# EAGLE design fabflash-mk-2.2-driver (EAGLE 6.5.0)
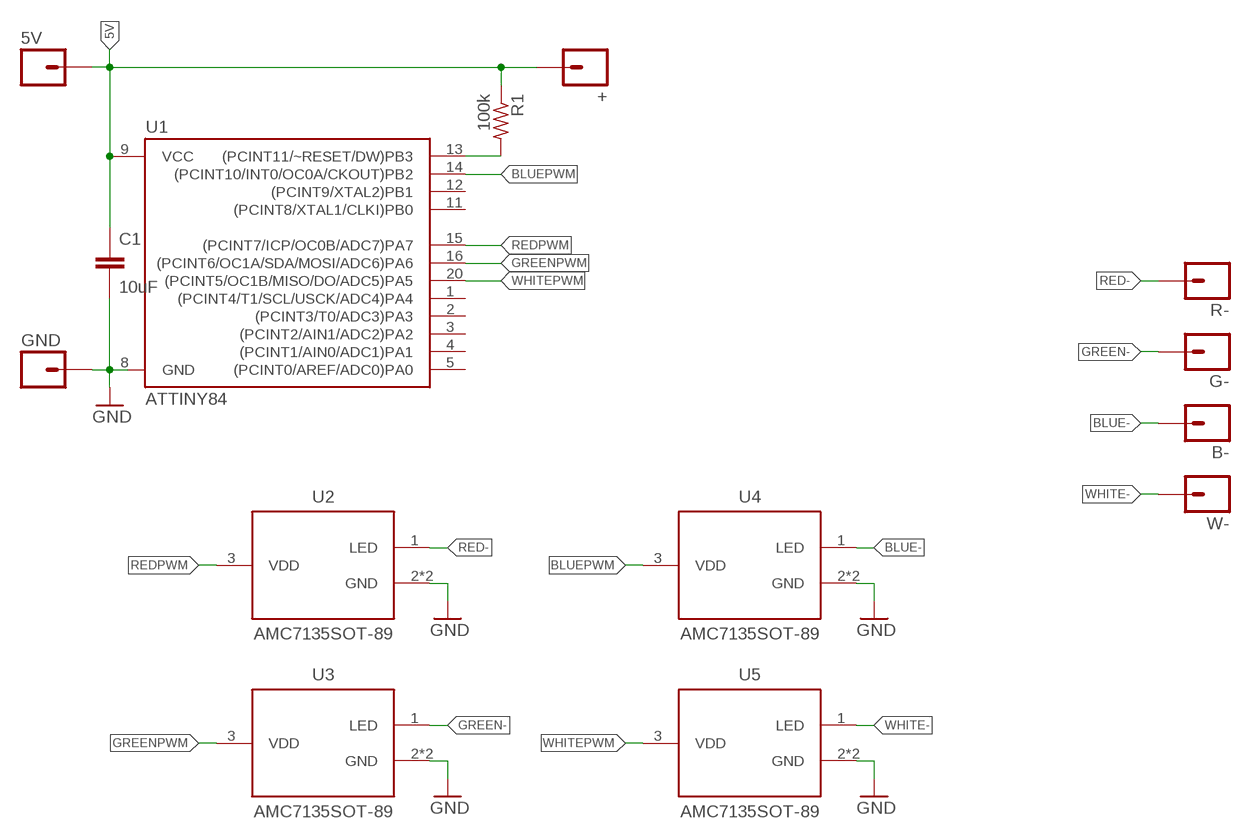
[diagram p0: schematic, sheet 1]

## Parts
5V  M01SMD_2X3MM  [1X01_SMD_2X3MM]
+  M01SMD_2X3MM  [1X01_SMD_2X3MM]
B-  M01SMD_2X3MM  [1X01_SMD_2X3MM]
C1  10uF  CAPACITOR-CERAMICC0805  [C0805]
G-  M01SMD_2X3MM  [1X01_SMD_2X3MM]
GND  M01NOT-A-VIA-NOPE  [1X01_NOSILK_NOSTOP]
R1  100k  RESISTORR0603  [R0603]
R-  M01SMD_2X3MM  [1X01_SMD_2X3MM]
U1  ATTINY84  ATTINY84ATTINY84-20MU  [QFN20]
U2  AMC7135SOT-89  [SOT89]
U3  AMC7135SOT-89  [SOT89]
U4  AMC7135SOT-89  [SOT89]
U5  AMC7135SOT-89  [SOT89]
W-  M01SMD_2X3MM  [1X01_SMD_2X3MM]

## Nets
5V: 5V.P$1 +.P$1 C1.1 R1.1 U1.9(VCC)
BLUE-: B-.P$1 U4.1(LED)
BLUEPWM: U1.14((PCINT10/INT0/OC0A/CKOUT)PB2) U4.3(VDD)
GND: C1.2 GND.P$1 U1.8(GND) U2.2(GND) U2.4(GND) U3.2(GND) U3.4(GND) U4.2(GND) U4.4(GND) U5.2(GND) U5.4(GND)
GREEN-: G-.P$1 U3.1(LED)
GREENPWM: U1.16((PCINT6/OC1A/SDA/MOSI/ADC6)PA6) U3.3(VDD)
N$1: R1.2 U1.13((PCINT11/~RESET/DW)PB3)
RED-: R-.P$1 U2.1(LED)
REDPWM: U1.15((PCINT7/ICP/OC0B/ADC7)PA7) U2.3(VDD)
WHITE-: U5.1(LED) W-.P$1
WHITEPWM: U1.20((PCINT5/OC1B/MISO/DO/ADC5)PA5) U5.3(VDD)
Unconnected: U1.1((PCINT4/T1/SCL/USCK/ADC4)PA4) U1.2((PCINT3/T0/ADC3)PA3) U1.3((PCINT2/AIN1/ADC2)PA2) U1.4((PCINT1/AIN0/ADC1)PA1) U1.5((PCINT0/AREF/ADC0)PA0) U1.11((PCINT8/XTAL1/CLKI)PB0) U1.12((PCINT9/XTAL2)PB1)

## Library data of the parts
5V + B- G- GND R- W- = A_butts:M01: Header 1 Standard 1-pin 0.1" header. Use with straight break away headers (SKU : PRT-00116), right angle break away headers (PRT-00553), swiss pins (PRT-00743), machine pins (PRT-00117), and female headers (PRT-00115).
C1 = A_butts:CAPACITOR-CERAMIC: CAPACITOR, European symbol
R1 = A_butts:RESISTOR: RESISTOR, American symbol
U1 = A_butts:ATTINY84: Atmel 14-pin 2/4/8kB flash uC
U2-U5 = A_butts:AMC7135

## Board
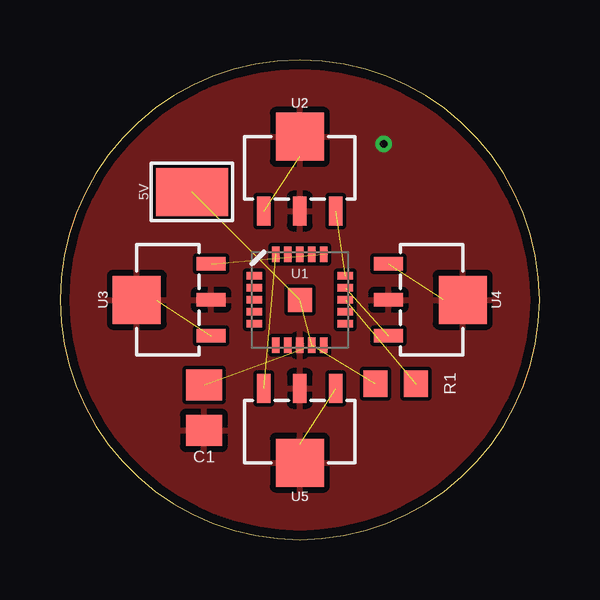
[diagram p1: board, top side]
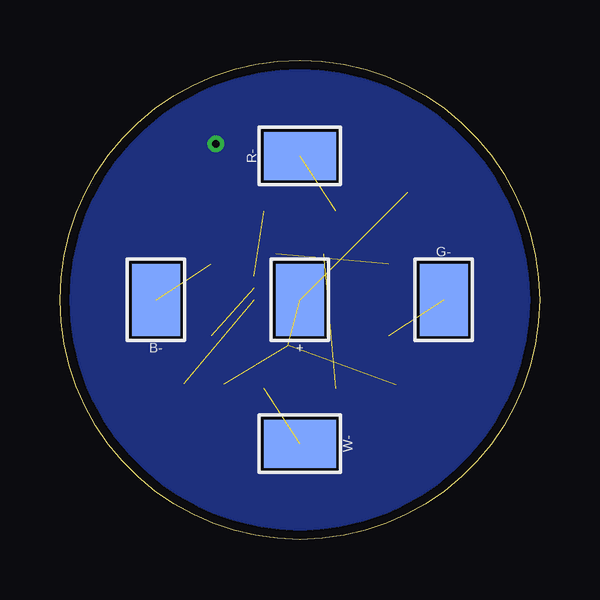
[diagram p2: board, bottom side, seen from below]

Size 20 x 20 mm. Coordinates in mm from the lower left corner, seen from the top.
Outline: 0,10 arc90 10,0 arc90 20,10 arc90 10,20 arc90 0,10
Copper layers (1*16): Top 0.0356mm / dielectric 1.5011mm / Bottom 0.0356mm
Design rules "LaenPCBOrder2": minimum track width 6mil, minimum drill 13mil, track to track 6mil, track to pad 6mil, pad to pad 6mil, via to via 6mil, smd to smd 6mil, copper to edge 15mil, drill to drill 6mil, minimum pad ring 7mil, minimum via ring 7mil, stop-mask expansion 3mil, vias tented up to drill 20mil, thermal gap 10mil

### Footprints (pad centres in the part's own frame; a part is rotated, then mirrored left to right if it is on the bottom)
1X01_SMD_2X3MM = smd 2 x 3: P$1 0,0
C0805 = smd 1.3 x 1.5: 1 -0.95,0; 2 0.95,0
1X01_NOSILK_NOSTOP = drill 0.33: P$1 0,0
R0603 = smd 1 x 1.1: 1 -0.85,0; 2 0.85,0
QFN20 = smd 1 x 1: 0 0,0 | smd 0.65 x 0.3: 1 -1.9,1; 2 -1.9,0.5; 3 -1.9,0; 4 -1.9,-0.5; 5 -1.9,-1; 11 1.9,-1; 12 1.9,-0.5; 13 1.9,0; 14 1.9,0.5; 15 1.9,1 | smd 0.3 x 0.65: 6 -1,-1.9; 7 -0.5,-1.9; 8 0,-1.9; 9 0.5,-1.9; 10 1,-1.9; 16 1,1.9; 17 0.5,1.9; 18 0,1.9; 19 -0.5,1.9; 20 -1,1.9
SOT89 = smd 0.58 x 1.2: 1 -1.5,-1.8; 2 0,-1.8; 3 1.5,-1.8 | smd 2 x 2: 4 0,1.3

### Placement (x,y rotation side)
5V  5.5,14.5 90 top
+  10,10 180 bottom
B-  16,10 180 bottom
C1  6,5.5 270 top
G-  4,10 0 bottom
GND  13.5,16.5 0 top
R1  14,6.5 0 top
R-  10,16 90 bottom
U1  10,10 0 top
U2  10,15.5 0 top
U3  4.5,10 90 top
U4  15.5,10 270 top
U5  10,4.5 180 top
W-  10,4 270 bottom

### Tracks (layer width: path | path; a pad name or v marks a point on that pad's centre or on a via)
5V  (4 unrouted)
BLUE-  (1 unrouted)
BLUEPWM  (1 unrouted)
GND
  pour Top: 10,0 arc-90 0,10 arc-90 10,20 arc-90 20,10 arc-90
  pour Bottom (rank 6): 10,0 arc-90 0,10 arc-90 10,20 arc-90 20,10 arc-90
GREEN-  (1 unrouted)
GREENPWM  (1 unrouted)
N$1  (1 unrouted)
RED-  (1 unrouted)
REDPWM  (1 unrouted)
WHITE-  (1 unrouted)
WHITEPWM  (1 unrouted)